# Altium schematic sheet Sheet1.SchDoc
size A4; SheetNumber: 1; SheetTotal: 1
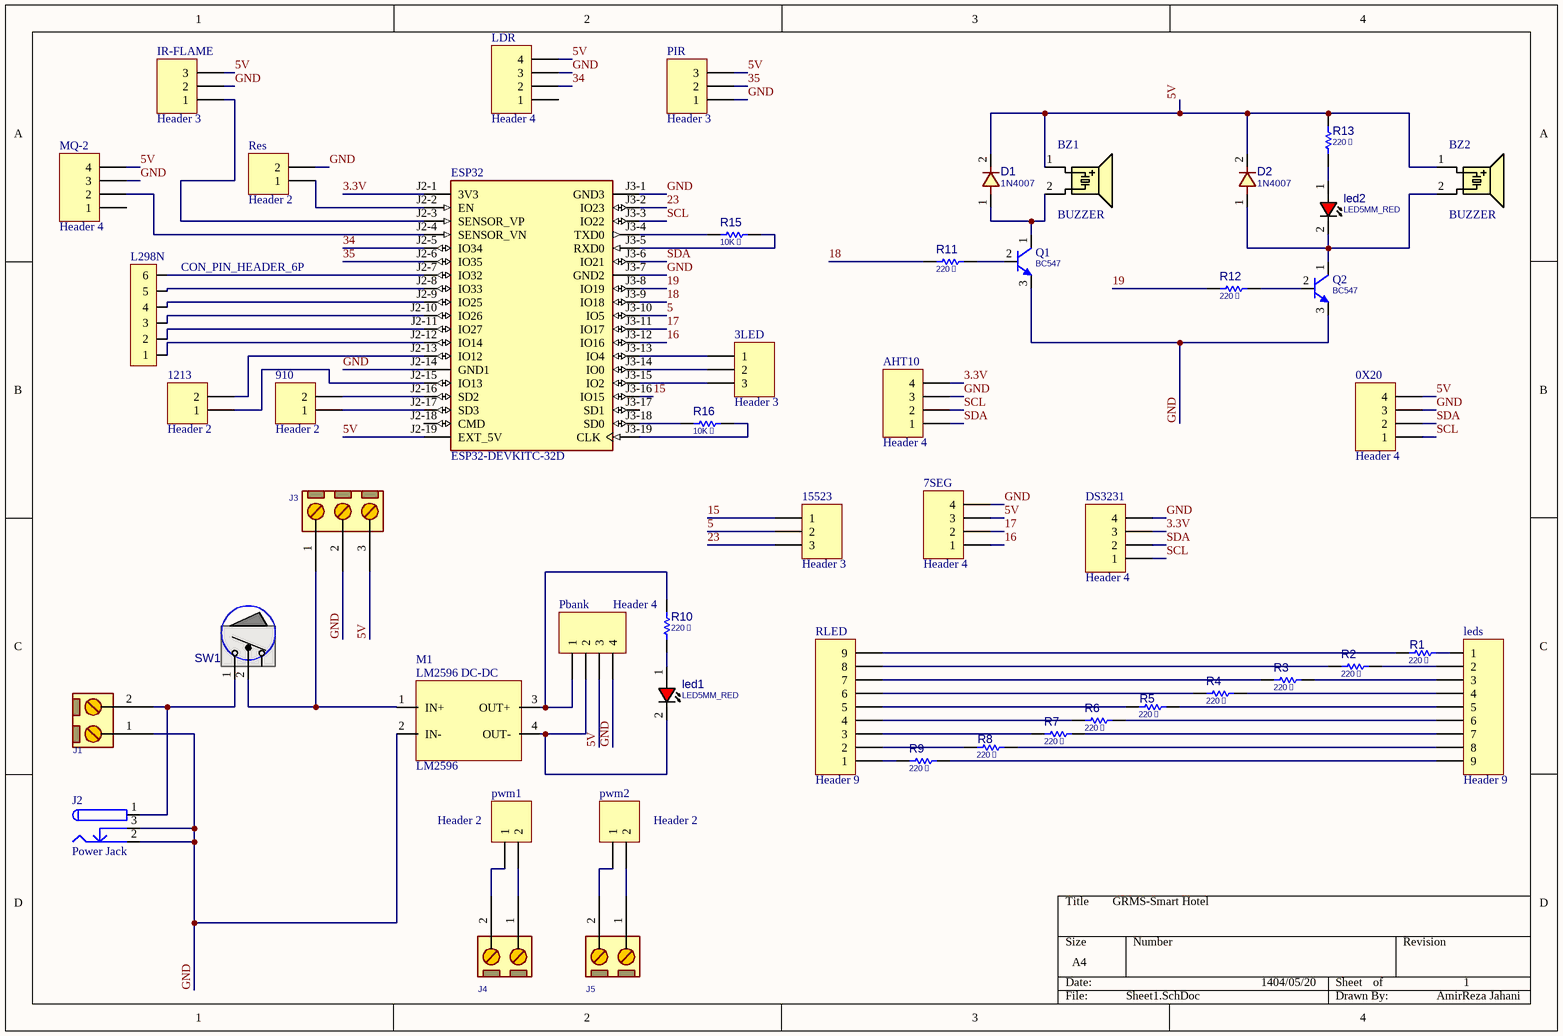
[diagram p0: Sheet1.SchDoc]

## Parts
0X20  Header 4  [HDR1X4]
3LED  Header 3  [HDR1X3]
7SEG  Header 4  [HDR1X4]
910  Header 2  [HDR1X2]
1213  Header 2  [HDR1X2]
15523  Header 3  [HDR1X3]
AHT10  Header 4  [HDR1X4]
BZ1  BUZZER  [BZ_C12]
BZ2  BUZZER  [BZ_C12]
D1  1N4007  [D_AX04_DO41]
D2  1N4007  [D_AX04_DO41]
DS3231  Header 4  [HDR1X4]
ESP32  ESP32-DEVKITC-32D  [MODULE_ESP32-DEVKITC-32D]
IR-FLAME  Header 3  [HDR1X3]
J1  CONN_TB2  [TBB_2]  (value not drawn)
J2  Power Jack  [Power Jack]
J3  CONN_TB3  [TBB_3]  (value not drawn)
J4  CONN_TB2  [TBB_2]  (value not drawn)
J5  CONN_TB2  [TBB_2]  (value not drawn)
L298N  CON_PIN_HEADER_6P  [CON_6P_header]
LDR  Header 4  [HDR1X4]
led1  LED5MM_RED  [LED5MM_RED]
led2  LED5MM_RED  [LED5MM_RED]
leds  Header 9  [HDR1X9]
M1  LM2596  [LM2596]
MQ-2  Header 4  [HDR1X4]
Pbank  Header 4  [HDR1X4]
PIR  Header 3  [HDR1X3]
pwm1  Header 2  [HDR1X2]
pwm2  Header 2  [HDR1X2]
Q1  BC547  [TO92_3]
Q2  BC547  [TO92_3]
R1  220ꭥ  [R025W_AX04]
R2  220ꭥ  [R025W_AX04]
R3  220ꭥ  [R025W_AX04]
R4  220ꭥ  [R025W_AX04]
R5  220ꭥ  [R025W_AX04]
R6  220ꭥ  [R025W_AX04]
R7  220ꭥ  [R025W_AX04]
R8  220ꭥ  [R025W_AX04]
R9  220ꭥ  [R025W_AX04]
R10  220ꭥ  [R025W_AX04]
R11  220ꭥ  [R025W_AX04]
R12  220ꭥ  [R025W_AX04]
R13  220ꭥ  [R025W_AX04]
R15  10Kꭥ  [R025W_AX04]
R16  10Kꭥ  [R025W_AX04]
Res  Header 2  [HDR1X2]
RLED  Header 9  [HDR1X9]
SW1  ToggleSwitch  [SWRCK_SPST_S_15X10]  (value not drawn)

## Nets
3.3V: AHT10.4 DS3231.3 ESP32.J2-1(3V3)
5: 15523.2 ESP32.J3-10(IO5)
5V: 0X20.4 7SEG.3 BZ1.1(A) BZ2.1(A) D1.2 D2.2 ESP32.J2-19(EXT_5V) IR-FLAME.3 J3.3 LDR.4 MQ-2.4 Pbank.3 PIR.3 R13.2
15: 15523.1 ESP32.J3-16(IO15)
16: 7SEG.1 ESP32.J3-12(IO16)
17: 7SEG.2 ESP32.J3-11(IO17)
18: ESP32.J3-9(IO18) R11.1
19: ESP32.J3-8(IO19) R12.1
23: 15523.3 ESP32.J3-2(IO23)
34: ESP32.J2-5(IO34) LDR.2
35: ESP32.J2-6(IO35) PIR.2
GND: 0X20.3 7SEG.4 AHT10.3 DS3231.4 ESP32.J2-14(GND1) ESP32.J3-1(GND3) ESP32.J3-7(GND2) IR-FLAME.2 J1.1 J2.2 J2.3 J3.2 LDR.3 M1.2(IN-) MQ-2.3 Pbank.4 PIR.1 Q1.3(E) Q2.3(E) Res.2
SCL: 0X20.1 AHT10.2 DS3231.1 ESP32.J3-3(IO22)
SDA: 0X20.2 AHT10.1 DS3231.2 ESP32.J3-6(IO21)
Net3LED_1: 3LED.1 ESP32.J3-13(IO4)
Net3LED_2: 3LED.2 ESP32.J3-14(IO0)
Net3LED_3: 3LED.3 ESP32.J3-15(IO2)
Net910_1: 910.1 ESP32.J2-17(SD3)
Net910_2: 910.2 ESP32.J2-16(SD2)
Net1213_1: 1213.1 ESP32.J2-15(IO13)
Net1213_2: 1213.2 ESP32.J2-13(IO12)
NetBZ1_2: BZ1.2(B) D1.1 Q1.1(C)
NetBZ2_2: BZ2.2(B) D2.1 led2.2(CATHODE) Q2.1(C)
NetESP32_J2-2: ESP32.J2-2(EN) Res.1
NetESP32_J2-3: ESP32.J2-3(SENSOR_VP) IR-FLAME.1
NetESP32_J2-4: ESP32.J2-4(SENSOR_VN) MQ-2.2
NetESP32_J2-7: ESP32.J2-7(IO32) L298N.6
NetESP32_J2-8: ESP32.J2-8(IO33) L298N.5
NetESP32_J2-9: ESP32.J2-9(IO25) L298N.4
NetESP32_J2-10: ESP32.J2-10(IO26) L298N.3
NetESP32_J2-11: ESP32.J2-11(IO27) L298N.2
NetESP32_J2-12: ESP32.J2-12(IO14) L298N.1(1)
NetESP32_J3-4: ESP32.J3-4(TXD0) R15.1
NetESP32_J3-5: ESP32.J3-5(RXD0) R15.2
NetESP32_J3-18: ESP32.J3-18(SD0) R16.1
NetESP32_J3-19: ESP32.J3-19(CLK) R16.2
NetJ1_2: J1.2 J2.1 SW1.1(T1)
NetJ3_1: J3.1 SW1.2(COM)
NetJ4_1: J4.1 pwm1.2
NetJ4_2: J4.2 pwm1.1
NetJ5_1: J5.1 pwm2.2
NetJ5_2: J5.2 pwm2.1
Netled1_1: led1.1(ANODE) R10.2
Netled1_2: led1.2(CATHODE) M1.4(OUT-) Pbank.2
Netled2_1: led2.1(ANODE) R13.1
Netleds_1: leds.1 R1.2
Netleds_2: leds.2 R2.2
Netleds_3: leds.3 R3.2
Netleds_4: leds.4 R4.2
Netleds_5: leds.5 R5.2
Netleds_6: leds.6 R6.2
Netleds_7: leds.7 R7.2
Netleds_8: leds.8 R8.2
Netleds_9: leds.9 R9.2
NetM1_3: M1.3(OUT+) Pbank.1 R10.1
NetQ1_2: Q1.2(B) R11.2
NetQ2_2: Q2.2(B) R12.2
NetR1_1: R1.1 RLED.9
NetR2_1: R2.1 RLED.8
NetR3_1: R3.1 RLED.7
NetR4_1: R4.1 RLED.6
NetR5_1: R5.1 RLED.5
NetR6_1: R6.1 RLED.4
NetR7_1: R7.1 RLED.3
NetR8_1: R8.1 RLED.2
NetR9_1: R9.1 RLED.1

Not connected (* = marked no-connect by the designer): ESP32 J2-18(CMD) J3-17(SD1); LDR 1; M1 1(IN+); MQ-2 1

## Notes on the sheet
- GRMS-Smart Hotel
- 1404/05/20
- 1
- AmirReza Jahani
- (in symbol LM2596) LM2596 DC-DC

## Library data of the parts
0X20 7SEG AHT10 DS3231 LDR MQ-2 Pbank = Header 4: Header, 4-Pin; LatestRevisionDate: 17-Jul-2002; LatestRevisionNote: Re-released for DXP Platform.; Publisher: Altium Limited
3LED 15523 IR-FLAME PIR = Header 3: Header, 3-Pin; LatestRevisionDate: 17-Jul-2002; LatestRevisionNote: Re-released for DXP Platform.; Publisher: Altium Limited
910 1213 pwm1 pwm2 Res = Header 2: Header, 2-Pin; LatestRevisionDate: 17-Jul-2002; LatestRevisionNote: Re-released for DXP Platform.; Publisher: Altium Limited
BZ1 BZ2 = BUZZER_C12: Buzzer, 12X8.5mm, Magnetic Transducer; MANF: Buerklin, CUI; MANF_P#: CM12P, MT03-H1BHP, BMT1205XH7.5, CEM-1201(50); PARAM2: 3~7VCC; PARAM: 2048 ±200 Hz; PRICE: PRICE; VALUE: BUZZER
D1 D2 = DIODE_THD_1N4007: DIODE, GENERAL PURPOSE, 1000V/1A; MANF: Diodes; DESC: DESCRIPTION; PARAM: 1000V, 1.15V; PARAM2: 1.5A; ASSEMBLY: ASSEMBLY; PRICE: PRICE; MANF_P#: 1N4007; VALUE: 1N4007
ESP32 = ESP32-DEVKITC-32D: WiFi Development Tools (802.11) ESP32 General Development Kit, ESP32-WROOM-32D on the board; MF: Espressif Systems; SnapEDA_Link: https://www.snapeda.com/parts/ESP32-DEVKITC-32D/Espressif+Systems/view-part/?ref=snap; Package: None; Value: *; MP: ESP32-DEVKITC-32D; Check_prices: https://www.snapeda.com/parts/ESP32-DEVKITC-32D/Espressif+Systems/view-part/?ref=eda
J1 J4 J5 = CONN_TB2: CONN, TERMINAL BLOCK, 5.08mm pitch; VALUE: CONN_TB2
J2 = Power Jack: Designer: Saeid Jorablo; Company: Personal; Project Name: Laser; Adding Date: 10/21/2009
J3 = CONN_TB3: CONN, TERMINAL BLOCK, 5.08mm pitch; VALUE: CONN_TB3
L298N = CON_PIN_HEADER_6P: 6-pin header 2.54mm pitch male; Manufacturer: XFCN; Manufacturer Part Number: PZ254V-11-06P; JLCPCB Part Numer: C492405
led1 led2 = LED_THD_5MM_RED: LED, THD, 5MM, RED; DESC: DESCRIPTION; MANF_P#: MANF_PART#; PARAM2: 2.2V; MANF: MANF; ASSEMBLY: ASSEMBLY; PRICE: PRICE; VALUE: LED5MM_RED
leds RLED = Header 9: Header, 9-Pin; LatestRevisionDate: 17-Jul-2002; LatestRevisionNote: Re-released for DXP Platform.; Publisher: Altium Limited
M1 = LM2596: Module
Q1 Q2 = NPN_BC547_TO92: BJT, NPN, 45v, 0.1A, THD, TO92; PARAM: 0.1A, Hfe110~800; PARAM2: 45v, 500mW; MANF: FAIRCHILD; MANF_P#: BC547; VALUE: BC547
R1-R13 R15 R16 = RES_THD: RESISTOR, THD; MANF_P#: RK73H1ETTP4701F; MANF: KOA SPEER; PARAM: 0.063W; DESC: DESCRIPTION; DIST#: MOUSER; PARAM2: 1%; ASSEMBLY: ASSEMBLY; PRICE: 100= 0.5$
  R1-R13: VALUE: 220ꭥ
  R15 R16: VALUE: 10Kꭥ
SW1 = SWROK_SPST_R_15X10: SWITCH, Rocker, SPST, THD, 15x10.5mm; DESC: DESCRIPTION; MANF: -; MANF_PART#: -; VALUE: ToggleSwitch; ASSEMBLY: ASSEMBLY; PARAM: -; PRICE: -